# EAGLE schematic SOL_R1 (EAGLE 7.7.0)
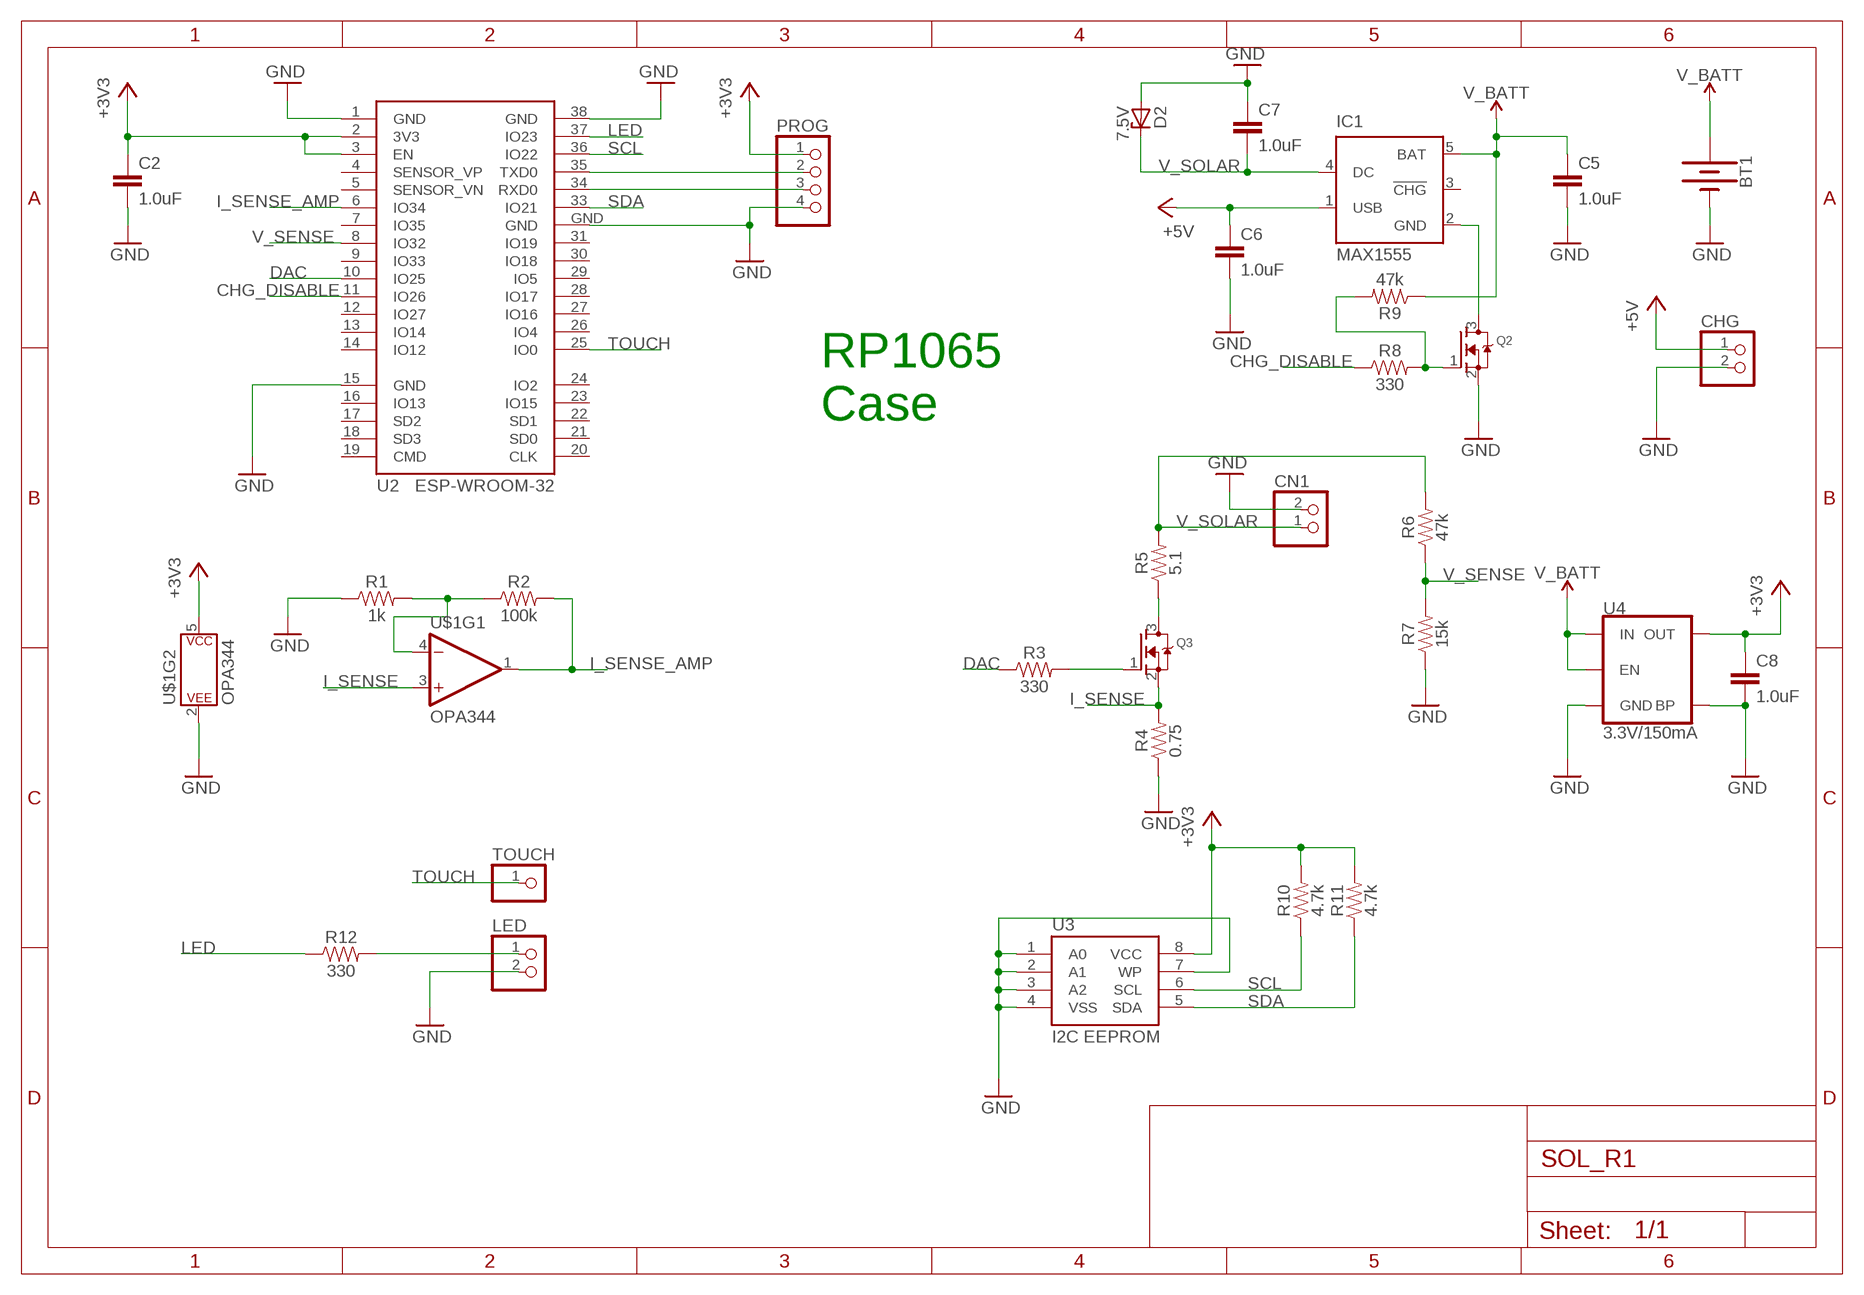
[diagram p0: schematic, sheet 1]

## Parts
BT1  BATTERY-18650  [BATTERY_18650-HOLDER]
C2  1.0uF  1.0UF-0805-25V-10%  [0805]
C5  1.0uF  1.0UF-0805-25V-10%  [0805]
C6  1.0uF  1.0UF-0805-25V-10%  [0805]
C7  1.0uF  1.0UF-0805-25V-10%  [0805]
C8  1.0uF  1.0UF-0805-25V-10%  [0805]
CHG  PINHD-1X2  [1X02]
CN1  JST_2PIN-THM-RA  [JST-PH-2-THM-RA]
D2  7.5V  ZENER-DIODEZD-5  [ZDIO-5]
IC1  MAX1555  [SOT23-5L]
LED  PINHD-1X2  [1X02]
PROG  PINHD-1X4  [1X04]
Q2  MOSFET-NREFLOW  [SOT23]
Q3  MOSFET-NREFLOW  [SOT23]
R1  1k  2.2KOHM-0603-1/10W-1%  [0603]
R2  100k  2.2KOHM-0603-1/10W-1%  [0603]
R3  330  2.2KOHM-0603-1/10W-1%  [0603]
R4  0.75  0.3OHM-0805-1/8W-1%  [0805]
R5  5.1  33OHM-0603-1/10W-1%  [0603]
R6  47k  47KOHM-0603-1/10W-1%  [0603]
R7  15k  15KOHM-0603-1/10W-1%  [0603]
R8  330  2.2KOHM-0603-1/10W-1%  [0603]
R9  47k  47KOHM-0603-1/10W-1%  [0603]
R10  4.7k  4.7KOHM-0603-1/10W-1%  [0603]
R11  4.7k  4.7KOHM-0603-1/10W-1%  [0603]
R12  330  2.2KOHM-0603-1/10W-1%  [0603]
TOUCH  PINHD-1X1  [1X01]
U2  ESP-WROOM-32  [ESP-WROOM-32]
U3  I2C EEPROM  EEPROM-I2CEIAJ  [SO08-EIAJ]
U4  3.3V/150mA  V_REG_MIC52053.3V  [SOT23-5]
U$1  OPA344  [SOT23-5]

## Nets
+3V3: C2.1 C8.1 PROG.1 R10.2 R11.2 U2.2(3V3) U2.3(EN) U3.8(VCC) U4.5(OUT) U$1.5(P$V+)
+5V: C6.1 CHG.1 IC1.1(USB)
CHG_DISABLE: R8.1 U2.11(IO26)
DAC: R3.1 U2.10(IO25)
GND: BT1.GND@1(-) C2.2 C5.2 C6.2 C7.1 C8.2 CHG.2 CN1.2 D2.A LED.2 PROG.4 Q2.2(S) R1.1 R4.1 R7.1 U2.1(GND) U2.15(GND) U2.38(GND) U2.GND U3.1(A0) U3.2(A1) U3.3(A2) U3.4(VSS) U3.7(WP) U4.2(GND) U4.4(BP) U$1.2(P$V-)
I_SENSE: Q3.2(S) R4.2 U$1.3(+IN)
I_SENSE_AMP: R2.2 U2.6(IO34) U$1.1(OUT)
LED: R12.1 U2.37(IO23)
N$1: R1.2 R2.1 U$1.4(-IN)
N$3: LED.1 R12.2
N$5: Q3.1(G) R3.2
N$6: IC1.2(GND) Q2.3(D)
N$7: Q3.3(D) R5.1
N$8: Q2.1(G) R8.2 R9.2
RXD: PROG.3 U2.34(RXD0)
SCL: R10.1 U2.36(IO22) U3.6(SCL)
SDA: R11.1 U2.33(IO21) U3.5(SDA)
TOUCH: TOUCH.1 U2.25(IO0)
TXD: PROG.2 U2.35(TXD0)
V_BATT: BT1.PWR@1(+) C5.1 IC1.5(BAT) R9.1 U4.1(IN) U4.3(EN)
V_SENSE: R6.1 R7.2 U2.8(IO32)
V_SOLAR: C7.2 CN1.1 D2.C IC1.4(DC) R5.2 R6.2
Unconnected: IC1.3(!CHG) U2.4(SENSOR_VP) U2.5(SENSOR_VN) U2.7(IO35) U2.9(IO33) U2.12(IO27) U2.13(IO14) U2.14(IO12) U2.16(IO13) U2.17(SD2) U2.18(SD3) U2.19(CMD) U2.20(CLK) U2.21(SD0) U2.22(SD1) U2.23(IO15) U2.24(IO2) U2.26(IO4) U2.27(IO16) U2.28(IO17) U2.29(IO5) U2.30(IO18) U2.31(IO19)

## Notes on the sheet
- RP1065
  Case

## Library data of the parts
BT1 = SparkFun-Batteries:BATTERY: Battery - Single Cell A variety of battery chemistries, sizes, and footprints. Device List: 20MM_PTH - Coin Cell Battery Holder - 20mm (PTH) <https://www.sparkfun.com/products/783> 12MM_SMD - Coin Cell Battery Holder - 12mm (SMD) <https://www.sparkfun.com/products/10592> 12MM_PTH - Coin Cell Battery Holder - 12mm (PTH) <https://www.sparkfun.com/products/7948> 20MM_SMD - 20mm Coin Cell Battery Holder (SMD) (2 legs) Used on the Big Time Watch Kit <https://www.sparkfun.com/products/11734> 20MM_SMD_4LEGS - Coin Cell Battery Holder - 20mm (SMD) <https://www.sparkfun.com/products/11892> 20MM_SMD_4LEGS_OVERPASTE - Coin Cell Battery Holder - 20mm (SMD) <https://www.sparkfun.com/products/11892> (Over-paste on the legs) 24.5MM_PTH - Coin Cell Battery Holder - 24.5mm (PTH) <https://www.sparkfun.com/products/8863> 9V - 9V Battery Holder - PC Mount Used on the SparkFun SparkPunk Sound Kit <https://www.sparkfun.com/products/11177> and SparkFun SparkPunk Sequencer Kit <https://www.sparkfun.com/products/12707> 18650 - Battery Holder - 18650 (PTH) <https://www.sparkfun.com/products/13113> AA - Battery Holder - 1xAA (PTH) <https://www.sparkfun.com/products/7949> AAA - Battery Holder - 1xAAA (PTH) <https://www.sparkfun.com/products/12718> AA_KIT - Battery Holder - 1xAA (PTH) <https://www.sparkfun.com/products/7949> Special kit package - pads only have exposed copper on one side of the board. AAA_KIT - Battery Holder - 1xAAA (PTH) <https://www.sparkfun.com/products/12718> Special kit package - pads only have exposed copper on one side of the board.; PROD_ID: BATT-12327; SF_SKU: PRT-13113
C2 C5-C8 = SparkFun-Capacitors:1.0UF: 1µF ceramic capacitors A capacitor is a passive two-terminal electrical component used to store electrical energy temporarily in an electric field.; PROD_ID: CAP-08064
CHG LED = pinhead:PINHD-1X2: PIN HEADER
CN1 = adafruit:JST_2PIN: JST 2-Pin Connectors of various flavors SMT-RA (S2B-PH-SM4) 4UConnector #17311 SMT (B2B-PH-SM4) THM-RA (S2B-PH) THM (B2B-PH)
D2 = diode:ZENER-DIODE: Z-Diode
IC1 = maxim:MAX1555: Dual-Input USB/AC Adapter 1-Cell Li+ Battery Chargers Source: http://www.maxim-ic.com .. MAX1551-MAX1555.pdf; MF: MAXIM; MPN: MAX1555EZK+T; OC_FARNELL: 1628222; OC_NEWARK: 59J2761
PROG = pinhead:PINHD-1X4: PIN HEADER
Q2 Q3 = adafruit:MOSFET-N: N-Channel Mosfet 2N7002E - 60V 260mA SOT23 [Digikey: 2N7002ET1GOSTR-ND] - REEL BSH103 - 30V 850mA SOT23 [Digikey: 568-5013-1-ND]
R1-R3 R8 R12 = SparkFun-Resistors:2.2KOHM: 2.2kΩ resistor A resistor is a passive two-terminal electrical component that implements electrical resistance as a circuit element. Resistors act to reduce current flow, and, at the same time, act to lower voltage levels within circuits. - Wikipedia; PROD_ID: RES-08272; VALUE: 2.2k
R4 = SparkFun-Resistors:0.3OHM: 0.3Ω resistor A resistor is a passive two-terminal electrical component that implements electrical resistance as a circuit element. Resistors act to reduce current flow, and, at the same time, act to lower voltage levels within circuits. - Wikipedia; PROD_ID: RES-11622; VALUE: 0.3
R5 = SparkFun-Resistors:33OHM: 33Ω resistor A resistor is a passive two-terminal electrical component that implements electrical resistance as a circuit element. Resistors act to reduce current flow, and, at the same time, act to lower voltage levels within circuits. - Wikipedia; PROD_ID: RES-08270; VALUE: 33
R6 R9 = SparkFun-Resistors:47KOHM: 47kΩ resistor A resistor is a passive two-terminal electrical component that implements electrical resistance as a circuit element. Resistors act to reduce current flow, and, at the same time, act to lower voltage levels within circuits. - Wikipedia; PROD_ID: RES-07871
R7 = SparkFun-Resistors:15KOHM: 15kΩ resistor A resistor is a passive two-terminal electrical component that implements electrical resistance as a circuit element. Resistors act to reduce current flow, and, at the same time, act to lower voltage levels within circuits. - Wikipedia; PROD_ID: RES-07854
R10 R11 = SparkFun-Resistors:4.7KOHM: 4.7kΩ resistor A resistor is a passive two-terminal electrical component that implements electrical resistance as a circuit element. Resistors act to reduce current flow, and, at the same time, act to lower voltage levels within circuits. - Wikipedia; PROD_ID: RES-07857
TOUCH = pinhead:PINHD-1X1: PIN HEADER
U2 = esp32:ESP-WROOM-32: Espressif Systems ESP-WROOM-32
U3 = SparkFun-IC-Memory:EEPROM-I2C: I2C EEPROMs, 24LC256 and others 24LC256 Series 256 kb I2C 2 Wire (32 k x 8 Bit) 2.5 V Serial EEPROM SMD - SOIC-8 Datasheet SparkFun Products SparkFun UDB5 - PIC UAV Development Board <https://www.sparkfun.com/products/11703> (GPS-11703); PROD_ID: NA-XXXXX
U4 = SparkFun-IC-Power:V_REG_MIC5205: V_REG MIC5205 Standard 3.3V, 5V, and Adjustable 150mA LDO voltage regulator in SOT-23 layout. Micrel part MIC5205. BP (by-pass) pin is used to lower output noise with 470pF cap, may be left open. On the adjustable version BP is used to set output.; PROD_ID: VREG-00822
U$1 = SparkFun-IC-Amplifiers:OPA344: Single gate rail-to-rail output op-amp. Inputs extend 300mV past rails. Datasheet <http://www.ti.com/product/OPA344> SparkFun Products SparkFun Low Current Sensor <https://www.sparkfun.com/products/8883> (SEN-08883) SparkFun Electret Microphone Breakout <https://www.sparkfun.com/products/12758> (BOB-12758); PROD_ID: IC-08251